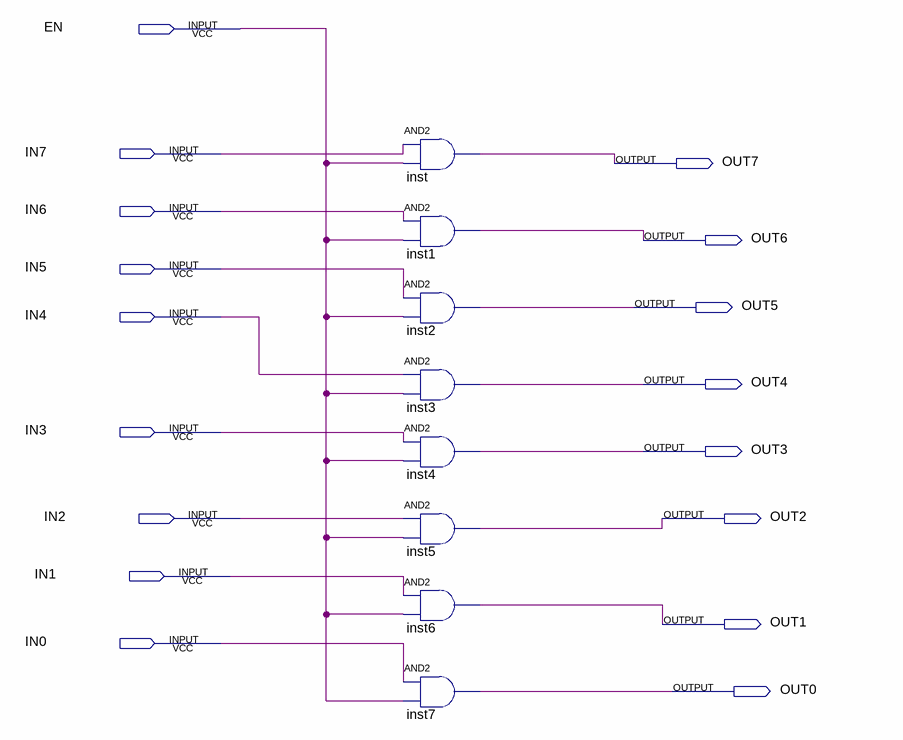
[diagram p0: schematic sheet]
// Quartus schematic AND_8_2_ENABLE.bdf as structural Verilog: 8 symbols, 17 pins
module AND_8_2_ENABLE (
  input  EN,
  input  IN7,
  input  IN6,
  input  IN5,
  input  IN4,
  input  IN3,
  input  IN2,
  input  IN1,
  input  IN0,
  output OUT7,
  output OUT6,
  output OUT5,
  output OUT4,
  output OUT3,
  output OUT2,
  output OUT1,
  output OUT0
);

  and inst (OUT7, IN7, EN);
  and inst1 (OUT6, IN6, EN);
  and inst2 (OUT5, IN5, EN);
  and inst3 (OUT4, IN4, EN);
  and inst4 (OUT3, IN3, EN);
  and inst5 (OUT2, IN2, EN);
  and inst6 (OUT1, IN1, EN);
  and inst7 (OUT0, IN0, EN);
endmodule
